# EAGLE schematic AtmoOrb (EAGLE 7.1.0)
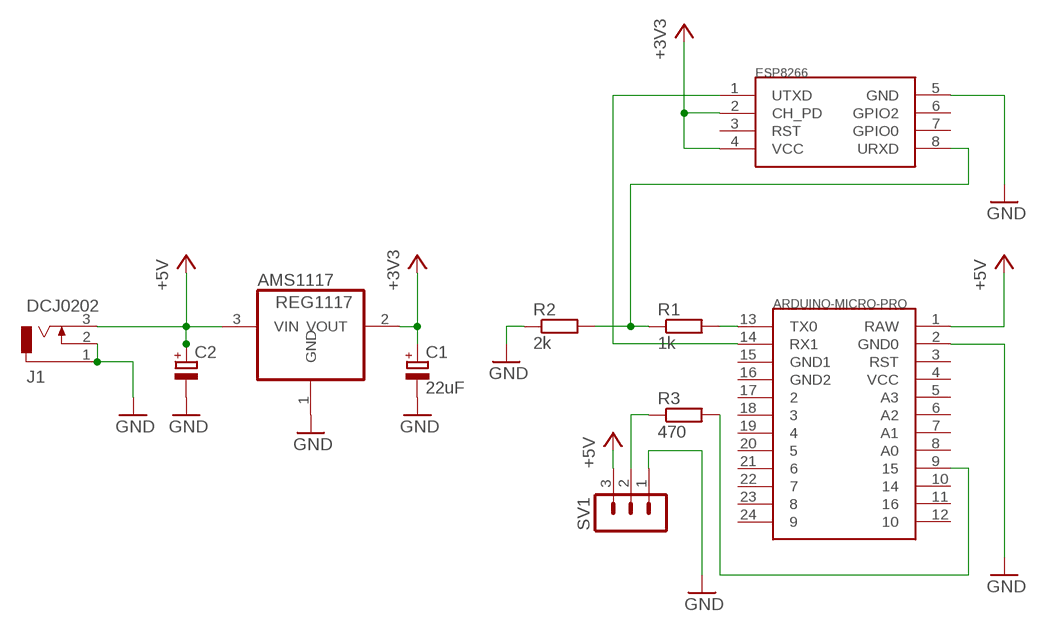
[diagram p0: schematic, sheet 1]

## Parts
AMS1117  REG1117  [SOT223]
ARDUINO-MICRO-PRO  ARDUINO_MICRO_PRO  [ARDUINO_MICRO_PRO]
C1  22uF  CPOL-EUTAP5-60  [TAP5-60]
C2  CPOL-EUTAP5-60  [TAP5-60]
ESP8266  ESP8266  [ESP8266]
J1  DCJ0202  [DCJ0202]
R1  1k  R-EU_0207/10  [0207/10]
R2  2k  R-EU_0207/10  [0207/10]
R3  470  R-EU_0207/10  [0207/10]
SV1  MA03-1  [MA03-1]

## Nets
+3V3: AMS1117.2(VOUT) C1.+ ESP8266.2(CH_PD) ESP8266.4(VCC)
+5V: AMS1117.3(VIN) ARDUINO-MICRO-PRO.1(RAW) C2.+ J1.3 SV1.3
GND: AMS1117.1(GND) ARDUINO-MICRO-PRO.2(GND0) C1.- C2.- ESP8266.5(GND) J1.1 J1.2 R2.1 SV1.1
N$1: ARDUINO-MICRO-PRO.13(TX0) R1.2
N$2: ESP8266.8(URXD) R1.1 R2.2
N$3: ARDUINO-MICRO-PRO.14(RX1) ESP8266.1(UTXD)
N$4: ARDUINO-MICRO-PRO.9 R3.2
N$5: R3.1 SV1.2
Unconnected: ARDUINO-MICRO-PRO.3(RST) ARDUINO-MICRO-PRO.4(VCC) ARDUINO-MICRO-PRO.5(A3) ARDUINO-MICRO-PRO.6(A2) ARDUINO-MICRO-PRO.7(A1) ARDUINO-MICRO-PRO.8(A0) ARDUINO-MICRO-PRO.10 ARDUINO-MICRO-PRO.11 ARDUINO-MICRO-PRO.12 ARDUINO-MICRO-PRO.15(GND1) ARDUINO-MICRO-PRO.16(GND2) ARDUINO-MICRO-PRO.17 ARDUINO-MICRO-PRO.18 ARDUINO-MICRO-PRO.19 ARDUINO-MICRO-PRO.20 ARDUINO-MICRO-PRO.21 ARDUINO-MICRO-PRO.22 ARDUINO-MICRO-PRO.23 ARDUINO-MICRO-PRO.24 ESP8266.3(RST) ESP8266.6(GPIO2) ESP8266.7(GPIO0)

## Library data of the parts
AMS1117 = burr-brown:REG1117: 800mA and 1A Low Dropout (LDO) Positive Regulator 1.8V, 2.5V, 2.85V, 3.3V, 5V, and Adj; MPN: REG1117; OC_FARNELL: 1097566; OC_NEWARK: 14P6981
ARDUINO-MICRO-PRO = ArduinoMicroPro:ARDUINO_MICRO_PRO
C1 C2 = rcl:CPOL-EU: POLARIZED CAPACITOR, European symbol
ESP8266 = ESP8266:ESP8266
J1 = con-jack:DCJ0202: DC POWER JACK Source: DCJ0202.pdf; OC_FARNELL: unknown; OC_NEWARK: unknown
R1-R3 = rcl:R-EU_: RESISTOR, European symbol
SV1 = con-lstb:MA03-1: PIN HEADER; OC_FARNELL: unknown; OC_NEWARK: unknown